# EAGLE design honda_bosch_a (EAGLE 9.6.2)
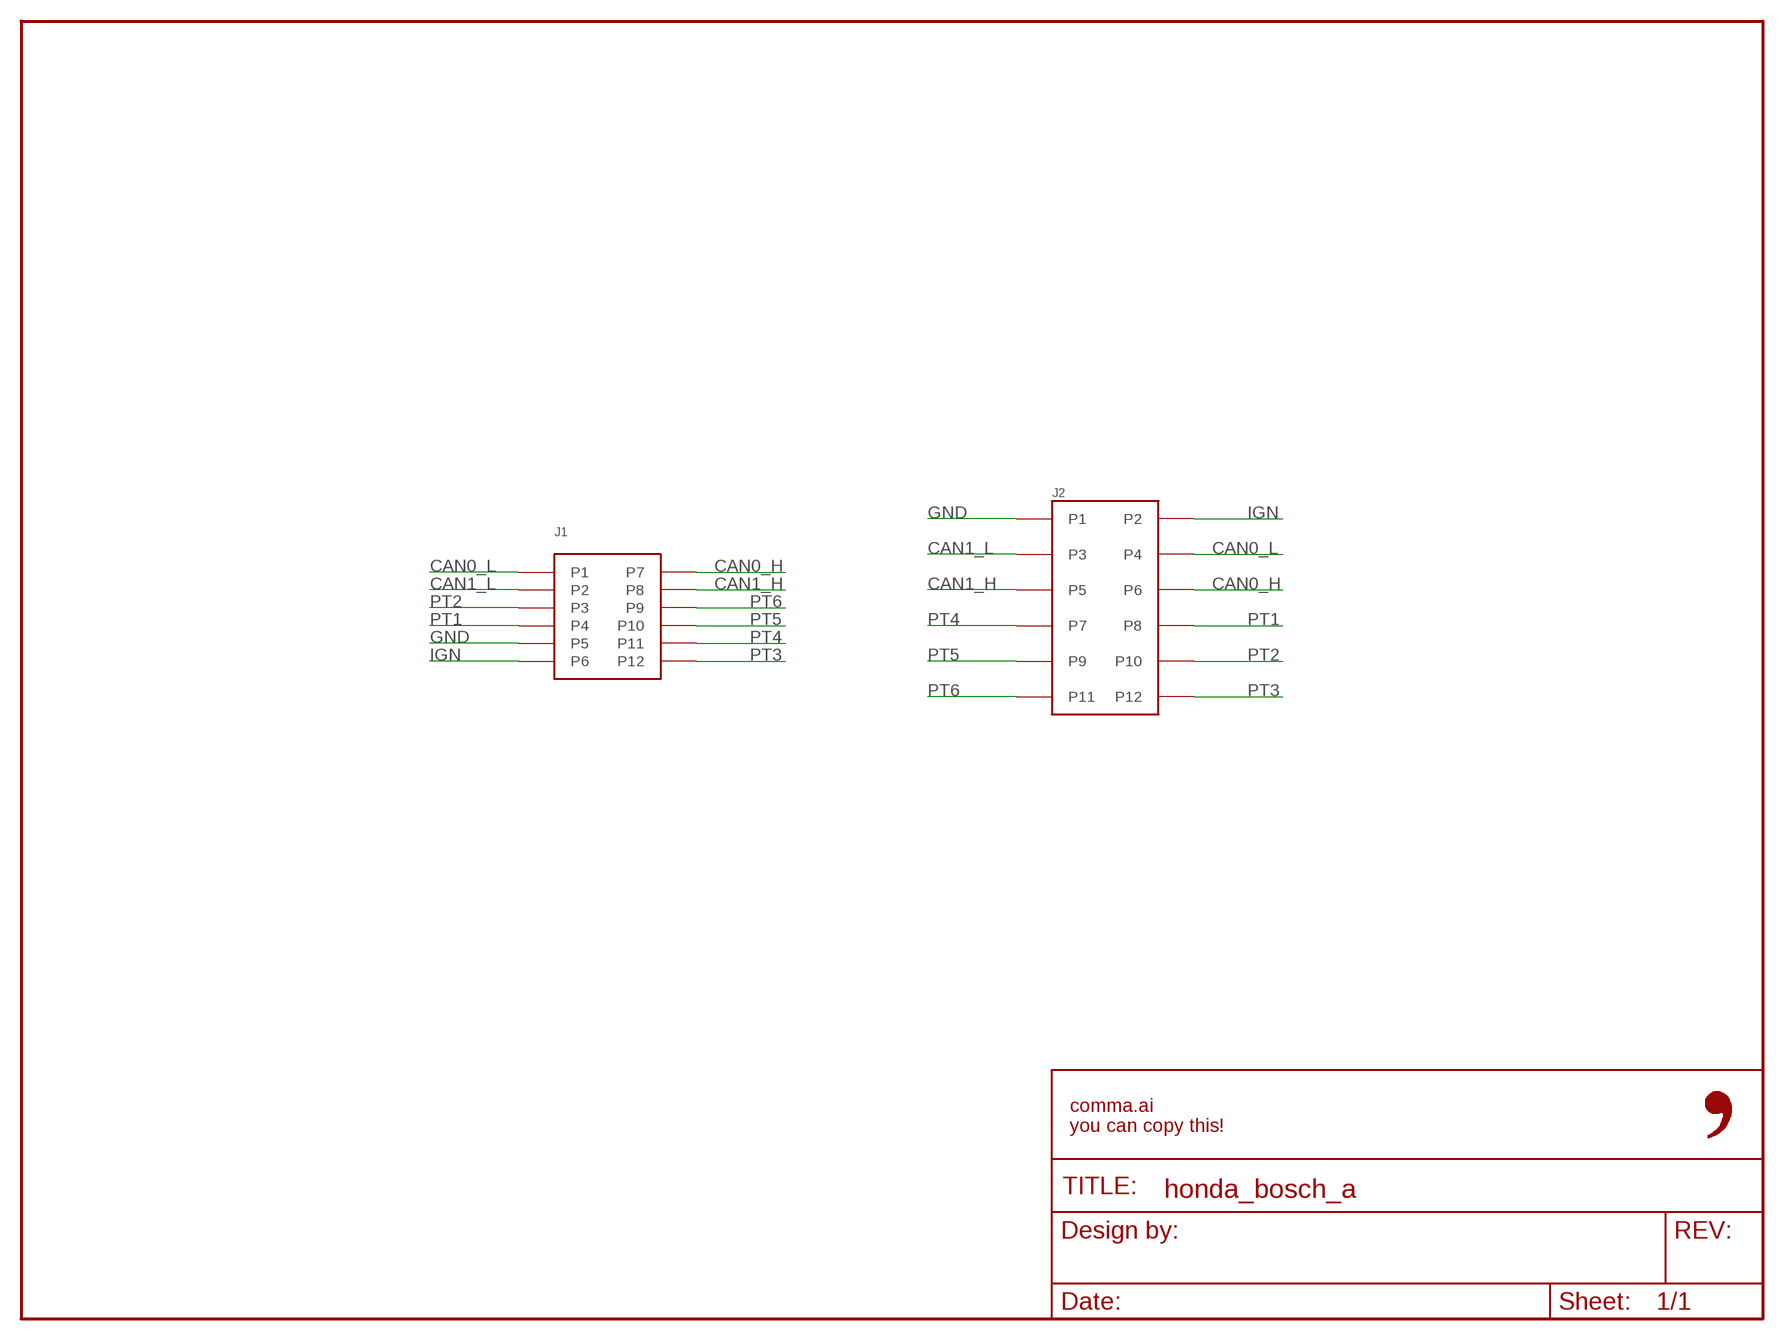
[diagram p0: schematic, sheet 1]

## Parts
FRAME1  FRAME-LETTER-OPENNO_PACKAGE  [DUMMY]
J1  MX34M12NF1  [MX34M12NF1]
J2  5018761240  [5018761240]

## Nets
CAN0_H: J1.P7 J2.P6
CAN0_L: J1.P1 J2.P4
CAN1_H: J1.P8 J2.P5
CAN1_L: J1.P2 J2.P3
GND: J1.P5 J2.P1
IGN: J1.P6 J2.P2
PT1: J1.P4 J2.P8
PT2: J1.P3 J2.P10
PT3: J1.P12 J2.P12
PT4: J1.P11 J2.P7
PT5: J1.P10 J2.P9
PT6: J1.P9 J2.P11

## Library data of the parts
FRAME1 = comma.ai:FRAME-LETTER-OPEN: Schematic Frame - Letter Standard 8.5x11 US Letter frame; DESIGNER: Nobody; VERSION: v01
J1 = comma.ai:MX34M12NF1; CPN: CAI-HARNESS-JAE-MX34M12NF1
J2 = comma.ai:5018761240; CPN: CAI-HARNESS-MOLEX-5018761240

## Board
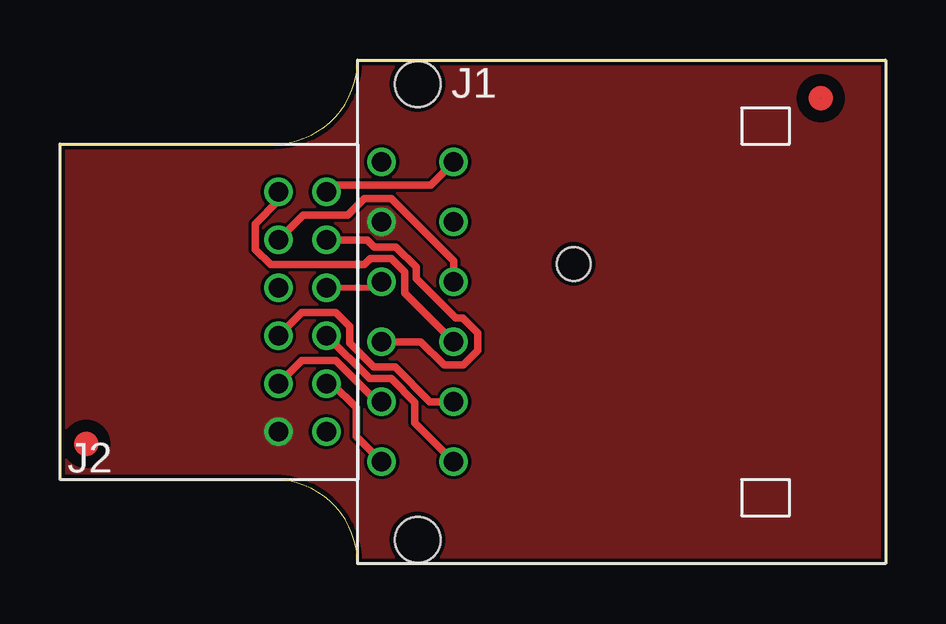
[diagram p1: board, top side]
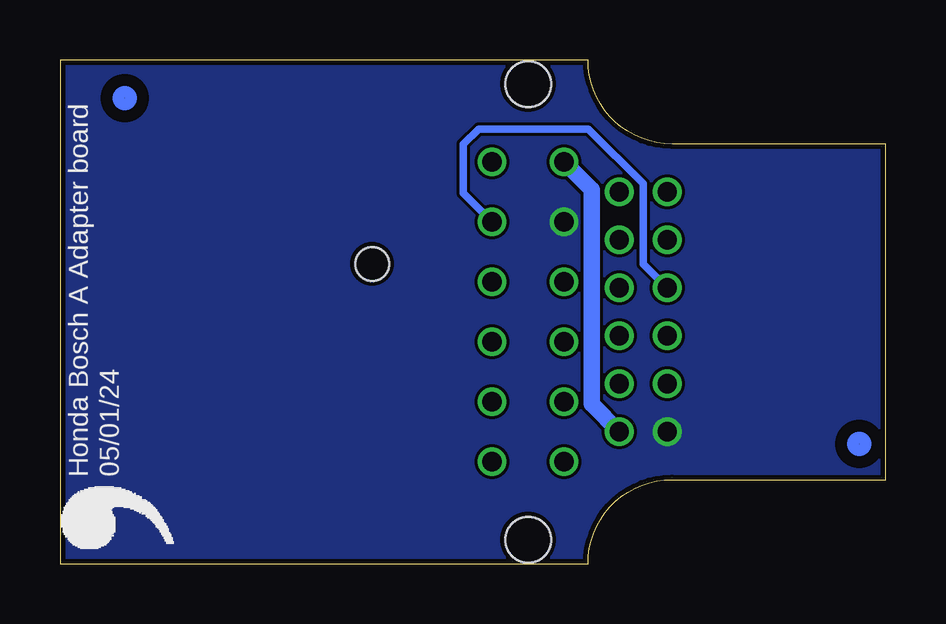
[diagram p2: board, bottom side, seen from below]

Size 34.4 x 21 mm. Coordinates in mm from the lower left corner, seen from the top.
Outline: 34.4,0 12.4,0 arc90 8.9,3.5 0,3.5 0,17.5 8.9,17.5 arc90 12.4,21 34.4,21 34.4,0
Copper layers (1*16): Top 0.035mm / dielectric 1.5mm / Bottom 0.035mm
Design rules "jlcpcb_2layer": minimum track width 5mil, minimum drill 12mil, track to track 5mil, track to pad 5mil, pad to pad 5mil, via to via 5mil, smd to smd 5mil, copper to edge 8mil, drill to drill 8mil, minimum pad ring 3mil, minimum via ring 3mil, stop-mask expansion 4mm, vias tented up to drill 20mil, thermal gap 10mil

### Footprints (pad centres in the part's own frame; a part is rotated, then mirrored left to right if it is on the bottom)
MX34M12NF1 = drill 0.8: P1 6.25,0; P2 3.75,0; P3 1.25,0; P4 -1.25,0; P5 -3.75,0; P6 -6.25,0; P7 6.25,3; P8 3.75,3; P9 1.25,3; P10 -1.25,3; P11 -3.75,3; P12 -6.25,3 | hole 1.9: -9.5,1.5; 9.5,1.5 | hole 1.4: -2,8
5018761240 = drill 0.8: P1 5,-1; P2 5,1; P3 3,-1; P4 3,1; P5 1,-1; P6 1,1; P7 -1,-1; P8 -1,1; P9 -3,-1; P10 -3,1; P11 -5,-1; P12 -5,1

### Placement (x,y rotation side)
E$1  [LOGO]  29.36,-0.06 90 bottom
FRAME1  10.1,20.66 180 top
J1  13.4,10.5 270 top
J2  10.1,10.5 270 top
U$2  [FIDUCIAL]  31.7,19.4 0 top
U$3  [FIDUCIAL]  1.1,5 0 top

### Tracks (layer width: path | path; a pad name or v marks a point on that pad's centre or on a via)
CAN0_H
  Top 0.305: J1.P7 14.79,5.86 14.79,6.72 13.8,7.71 12.91,7.71 11.12,9.5 J2.P6
CAN0_L
  Top 0.305: J1.P1 12.34,5.31 12.34,6.51 11.35,7.5 J2.P4
CAN1_H
  Top 0.305: J2.P5 10.07,10.47 11.49,10.47 12.07,9.89 12.07,9.2 13.08,8.2 13.96,8.2 15.41,6.75 J1.P8
CAN1_L
  Top 0.305: J1.P2 13.21,6.75 11.5,8.46 10.06,8.46 J2.P3
GND
  pour Top (no thermals): -0.9,21.5 36.1,21.5 36.1,-1.5 -0.9,-1.5
  pour Bottom (no thermals): -1.9,22.5 37.1,22.5 37.1,-2.5 -1.9,-2.5
IGN
  Bottom 0.68: J1.P6 12.25,15.6 12.25,6.65 J2.P2
PT1
  Top 0.254: J1.P4 13.15,11.5 J2.P8
PT2
  Top 0.305: J2.P10 12.8,13.49 13.08,13.21 14,13.21 14.85,12.36 14.85,11.88 16.49,10.24 16.78,10.24 17.4,9.62 17.4,8.88 16.8,8.28 16,8.28 15.03,9.25 J1.P3
PT3
  Top 0.305: J1.P12 15.44,15.79 11.39,15.79 J2.P12
PT4
  Bottom 0.305: J2.P7 10.1,12.5 10.1,15.83 12.39,18.12 16.96,18.12 17.59,17.48 17.59,15.44 J1.P11
PT5
  Top 0.305: J2.P9 10.14,14.54 11.99,14.54 12.67,15.22 13.8,15.22 16.4,12.62 J1.P10
PT6
  Top 0.305: J2.P11 9.1,15.13 8.14,14.17 8.14,13.1 8.78,12.46 12.67,12.46 12.93,12.72 13.8,12.72 14.37,12.15 14.37,11.28 J1.P9

### Text on the board
bPlace: 05/01/24 | Honda Bosch A Adapter board